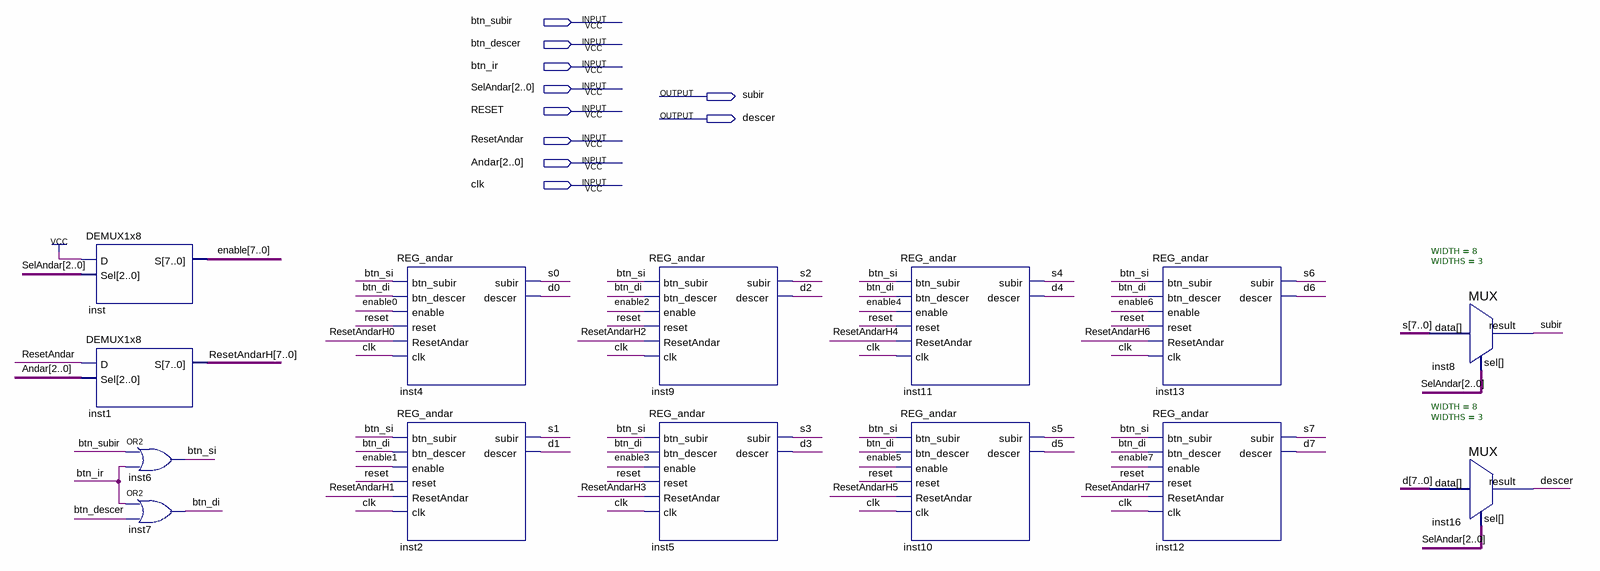
[diagram p0: schematic sheet]
// Quartus schematic MEM_elevador.bdf as structural Verilog: 14 symbols, 10 pins
module MEM_elevador (
  input  btn_subir,
  input  btn_descer,
  input  btn_ir,
  input  [2:0] SelAndar,
  input  RESET,
  input  ResetAndar,
  input  [2:0] Andar,
  input  clk,
  output subir,
  output descer
);

  wire btn_di, btn_si;
  wire [7:0] d, enable, ResetAndarH, s;

  DEMUX1x8 inst (.D(1'b1), .Sel(SelAndar), .S(enable));
  DEMUX1x8 inst1 (.D(ResetAndar), .Sel(Andar), .S(ResetAndarH));
  or inst6 (btn_si, btn_subir, btn_ir);
  or inst7 (btn_di, btn_ir, btn_descer);
  REG_andar inst4 (
    .btn_subir(btn_si), .btn_descer(btn_di), .enable(enable[0]), .reset(RESET), .ResetAndar(ResetAndarH[0]),
    .clk(clk), .subir(s[0]), .descer(d[0]));
  REG_andar inst2 (
    .btn_subir(btn_si), .btn_descer(btn_di), .enable(enable[1]), .reset(RESET), .ResetAndar(ResetAndarH[1]),
    .clk(clk), .subir(s[1]), .descer(d[1]));
  REG_andar inst9 (
    .btn_subir(btn_si), .btn_descer(btn_di), .enable(enable[2]), .reset(RESET), .ResetAndar(ResetAndarH[2]),
    .clk(clk), .subir(s[2]), .descer(d[2]));
  REG_andar inst5 (
    .btn_subir(btn_si), .btn_descer(btn_di), .enable(enable[3]), .reset(RESET), .ResetAndar(ResetAndarH[3]),
    .clk(clk), .subir(s[3]), .descer(d[3]));
  REG_andar inst11 (
    .btn_subir(btn_si), .btn_descer(btn_di), .enable(enable[4]), .reset(RESET), .ResetAndar(ResetAndarH[4]),
    .clk(clk), .subir(s[4]), .descer(d[4]));
  REG_andar inst10 (
    .btn_subir(btn_si), .btn_descer(btn_di), .enable(enable[5]), .reset(RESET), .ResetAndar(ResetAndarH[5]),
    .clk(clk), .subir(s[5]), .descer(d[5]));
  REG_andar inst13 (
    .btn_subir(btn_si), .btn_descer(btn_di), .enable(enable[6]), .reset(RESET), .ResetAndar(ResetAndarH[6]),
    .clk(clk), .subir(s[6]), .descer(d[6]));
  REG_andar inst12 (
    .btn_subir(btn_si), .btn_descer(btn_di), .enable(enable[7]), .reset(RESET), .ResetAndar(ResetAndarH[7]),
    .clk(clk), .subir(s[7]), .descer(d[7]));
  MUX #(.WIDTH(8), .WIDTHS(3)) inst8 (.data(s), .sel(SelAndar), .result(subir));
  MUX #(.WIDTH(8), .WIDTHS(3)) inst16 (.data(d), .sel(SelAndar), .result(descer));
endmodule
